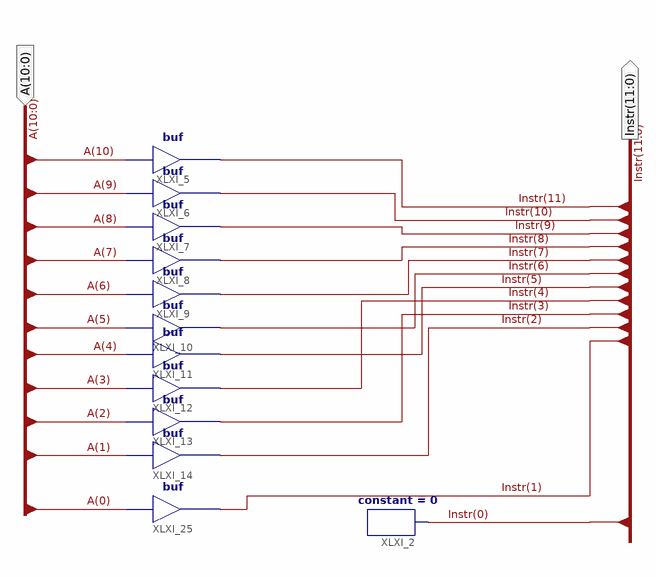
[diagram p0: schematic sheet 1]
// Xilinx ISE schematic leftshift1bit.sch (spartan3e) as structural Verilog: 12 symbols, 2 ports
module leftshift1bit (
  input  [10:0] A,
  output [11:0] Instr
);

  buf XLXI_6 (Instr[10], A[9]);
  buf XLXI_7 (Instr[9], A[8]);
  buf XLXI_8 (Instr[8], A[7]);
  buf XLXI_9 (Instr[7], A[6]);
  buf XLXI_10 (Instr[6], A[5]);
  buf XLXI_11 (Instr[5], A[4]);
  buf XLXI_12 (Instr[4], A[3]);
  buf XLXI_13 (Instr[3], A[2]);
  buf XLXI_14 (Instr[2], A[1]);
  buf XLXI_5 (Instr[11], A[10]);
  buf XLXI_25 (Instr[1], A[0]);
  constant #(.CValue("0")) XLXI_2 (.O(Instr[0]));
endmodule
